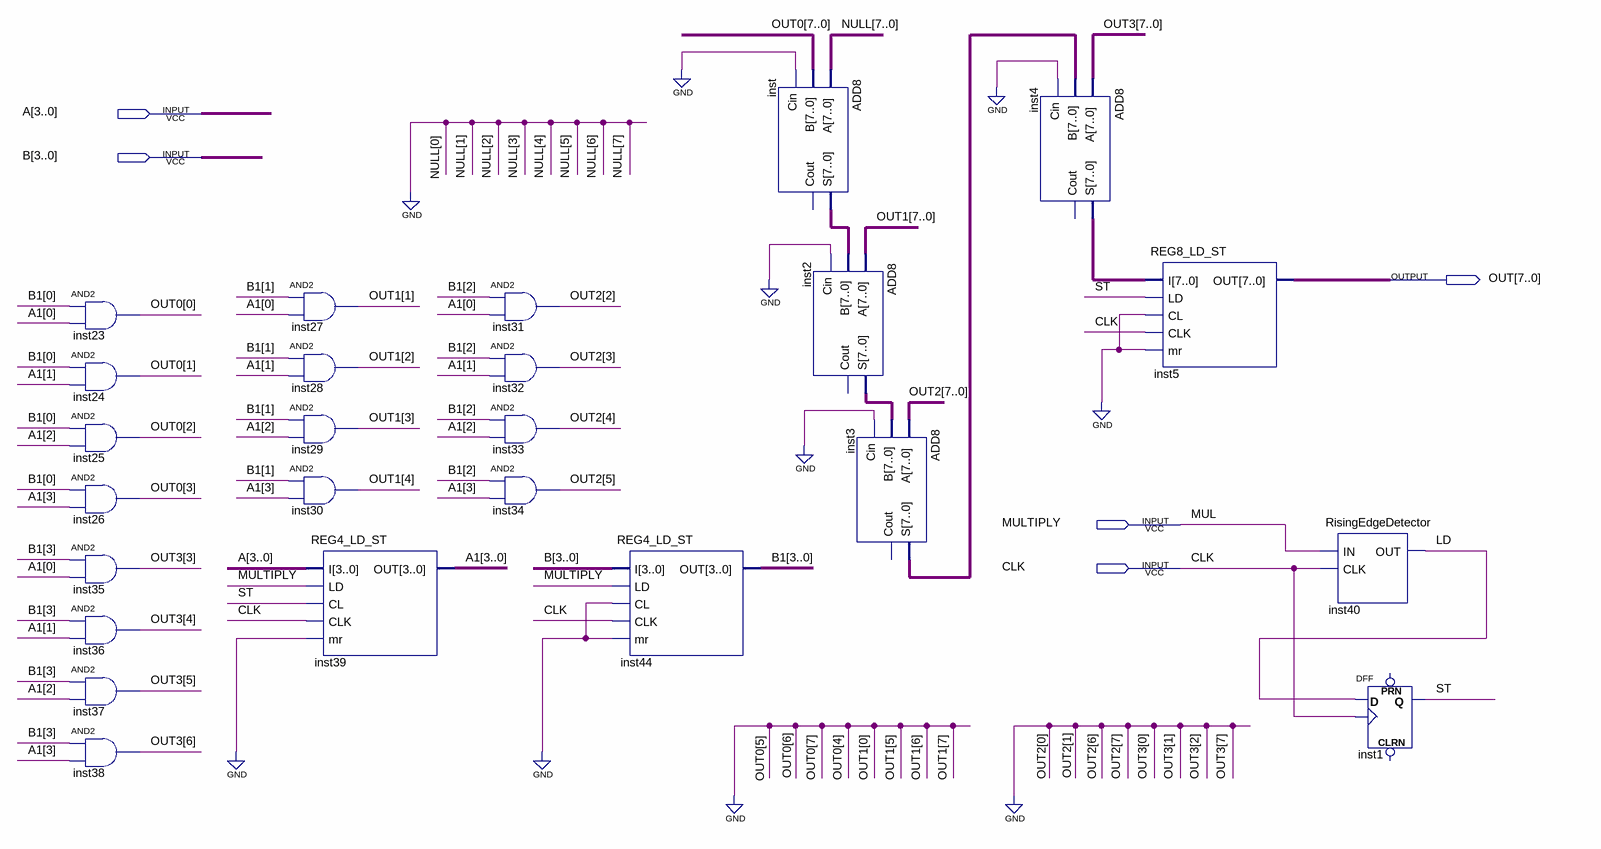
[diagram p0: schematic sheet]
// Quartus schematic MUL2.bdf as structural Verilog: 25 symbols, 5 pins
module MUL2 (
  input  [3:0] A,
  input  [3:0] B,
  input  MULTIPLY,
  input  CLK,
  output [7:0] OUT
);

  wire LD, ST;
  wire [3:0] A1, B1, OUT0;
  wire [4:1] OUT1;
  wire [5:2] OUT2;
  wire [6:3] OUT3;
  wire [7:0] inst2_s, inst3_s, inst4_s, inst_s;

  and inst23 (OUT0[0], B1[0], A1[0]);
  and inst24 (OUT0[1], B1[0], A1[1]);
  and inst25 (OUT0[2], B1[0], A1[2]);
  and inst26 (OUT0[3], B1[0], A1[3]);
  and inst35 (OUT3[3], B1[3], A1[0]);
  and inst36 (OUT3[4], B1[3], A1[1]);
  and inst37 (OUT3[5], B1[3], A1[2]);
  and inst38 (OUT3[6], B1[3], A1[3]);
  and inst27 (OUT1[1], B1[1], A1[0]);
  and inst28 (OUT1[2], B1[1], A1[1]);
  and inst29 (OUT1[3], B1[1], A1[2]);
  and inst30 (OUT1[4], B1[1], A1[3]);
  REG4_LD_ST inst39 (.I(A), .LD(MULTIPLY), .CL(ST), .CLK(CLK), .mr(1'b0), .OUT(A1));
  and inst31 (OUT2[2], B1[2], A1[0]);
  and inst32 (OUT2[3], B1[2], A1[1]);
  and inst33 (OUT2[4], B1[2], A1[2]);
  and inst34 (OUT2[5], B1[2], A1[3]);
  REG4_LD_ST inst44 (.I(B), .LD(MULTIPLY), .CL(1'b0), .CLK(CLK), .mr(1'b0), .OUT(B1));
  ADD8 inst (.A({8{1'b0}}), .B({4'b0000, OUT0}), .Cin(1'b0), .S(inst_s));  // open: Cout
  ADD8 inst2 (.A({3'b000, OUT1, 1'b0}), .B(inst_s), .Cin(1'b0), .S(inst2_s));  // open: Cout
  ADD8 inst3 (.A({2'b00, OUT2, 2'b00}), .B(inst2_s), .Cin(1'b0), .S(inst3_s));  // open: Cout
  ADD8 inst4 (.A({1'b0, OUT3, 3'b000}), .B(inst3_s), .Cin(1'b0), .S(inst4_s));  // open: Cout
  REG8_LD_ST inst5 (.I(inst4_s), .LD(ST), .CL(1'b0), .CLK(CLK), .mr(1'b0), .OUT(OUT));
  RisingEdgeDetector inst40 (.IN(MULTIPLY), .CLK(CLK), .OUT(LD));
  DFF inst1 (.CLK(CLK), .D(LD), .Q(ST));  // open: CLRN, PRN

  // Other names for the same wires on the sheet: MUL = MULTIPLY
endmodule
